# EAGLE schematic PKE Meter v4 (EAGLE 9.7.0)
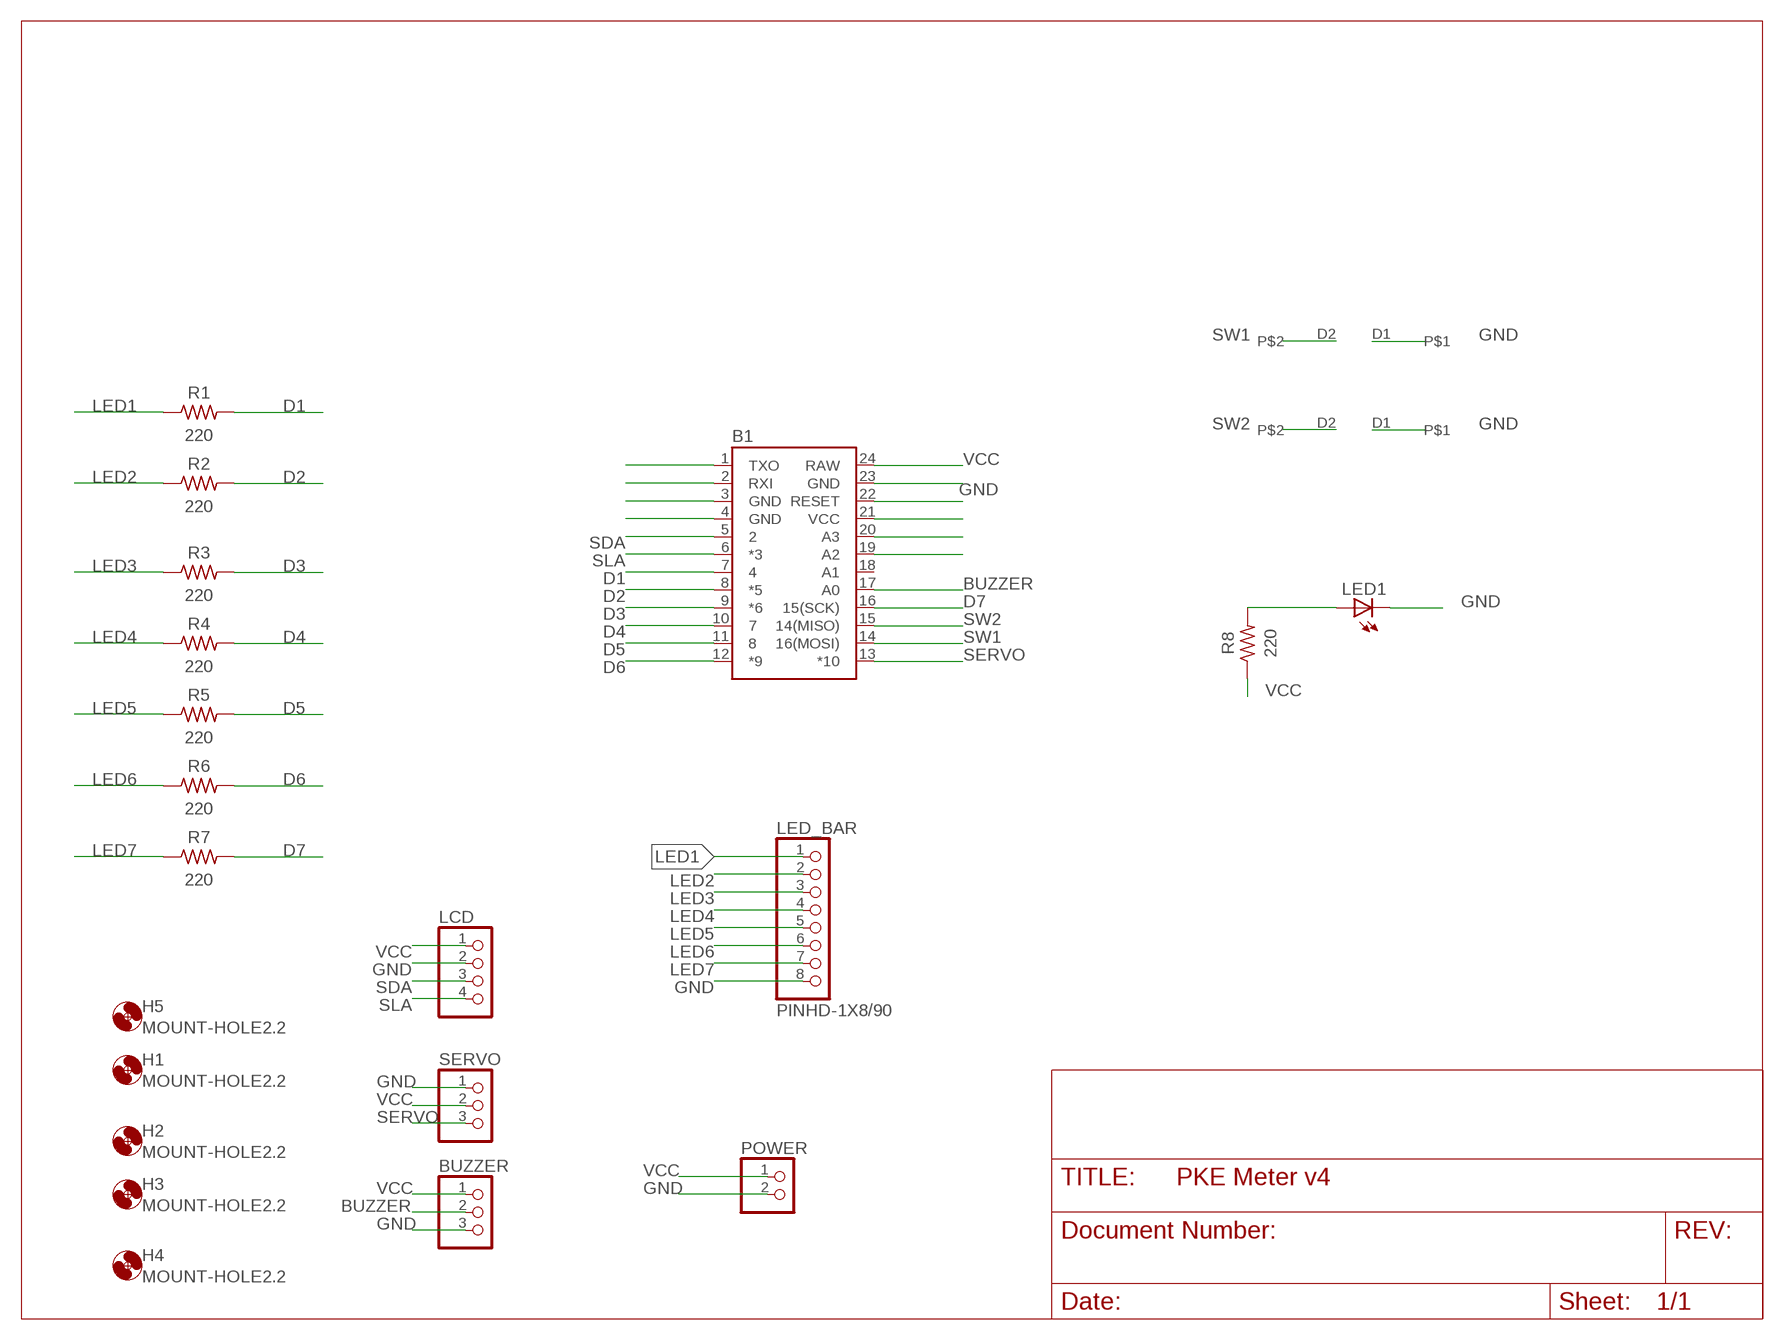
[diagram p0: schematic, sheet 1]

## Parts
B1  SPARKFUN_PRO_MICRO  [SPARKFUN_PRO_MICRO]
BUZZER  PINHD-1X3  [1X03]
H1  MOUNT-HOLE2.2  [2,2]
H2  MOUNT-HOLE2.2  [2,2]
H3  MOUNT-HOLE2.2  [2,2]
H4  MOUNT-HOLE2.2  [2,2]
H5  MOUNT-HOLE2.2  [2,2]
LCD  PINHD-1X4  [1X04]
LED1  LEDSQR2X5  [LED2X5]
LED_BAR  PINHD-1X8/90  [1X08/90]
POWER  PINHD-1X2  [1X02]
R1  220  R-US_AXIAL-11.7MM-PITCH  [RESAD1176W63L850D250B]
R2  220  R-US_AXIAL-11.7MM-PITCH  [RESAD1176W63L850D250B]
R3  220  R-US_AXIAL-11.7MM-PITCH  [RESAD1176W63L850D250B]
R4  220  R-US_AXIAL-11.7MM-PITCH  [RESAD1176W63L850D250B]
R5  220  R-US_AXIAL-11.7MM-PITCH  [RESAD1176W63L850D250B]
R6  220  R-US_AXIAL-11.7MM-PITCH  [RESAD1176W63L850D250B]
R7  220  R-US_AXIAL-11.7MM-PITCH  [RESAD1176W63L850D250B]
R8  220  R-US_AXIAL-7.2MM-PITCH  [RESAD724W46L381D178B]
SERVO  PINHD-1X3  [1X03]
U$1  SWITCH  [SWITCH]
U$2  SWITCH  [SWITCH]

## Nets
BUZZER: B1.17(A0) BUZZER.2
D1: B1.7 R1.2
D2: B1.8(*5) R2.2
D3: B1.9(*6) R3.2
D4: B1.10 R4.2
D5: B1.11 R5.2
D6: B1.12(*9) R6.2
D7: B1.16(15(SCK)) R7.2
GND: B1.23(GND) BUZZER.3 LCD.2 LED1.K(C) LED_BAR.8 POWER.2 SERVO.1 U$1.D1 U$2.D1
LED1: LED_BAR.1 R1.1
LED2: LED_BAR.2 R2.1
LED3: LED_BAR.3 R3.1
LED4: LED_BAR.4 R4.1
LED5: LED_BAR.5 R5.1
LED6: LED_BAR.6 R6.1
LED7: LED_BAR.7 R7.1
N$29: B1.19(A2)
N$30: B1.20(A3)
N$31: B1.4(GND)
N$34: B1.3(GND)
N$35: B1.22(RESET)
N$36: B1.2(RXI)
N$37: B1.1(TXO)
N$38: B1.21(VCC)
N$54: LED1.A R8.2
SDA: B1.5 LCD.3
SERVO: B1.13(*10) SERVO.3
SLA: B1.6(*3) LCD.4
SW1: B1.14(16(MOSI)) U$1.D2
SW2: B1.15(14(MISO)) U$2.D2
VCC: B1.24(RAW) BUZZER.1 LCD.1 POWER.1 R8.1 SERVO.2
Unconnected: B1.18(A1)

## Library data of the parts
B1 = Personal Library:SPARKFUN_PRO_MICRO: SparkFun Pro Micro Atmega32U4 compatible footprint. SparkFun Products: 3.3V/8MHz <https://www.sparkfun.com/products/12587> 5V/16MHz <https://www.sparkfun.com/products/12640>
BUZZER SERVO = adafruit:PINHD-1X3: PIN HEADER
H1-H5 = holes:MOUNT-HOLE: MOUNTING HOLE with drill center marker
LCD = pinhead:PINHD-1X4: PIN HEADER
LED1 = adafruit:LED: LED OSRAM: - CHIPLED LG R971, LG N971, LY N971, LG Q971, LY Q971, LO R971, LY R971 LH N974, LH R974 LS Q976, LO Q976, LY Q976 LO Q996 - Hyper CHIPLED LW Q18S LB Q993, LB Q99A, LB R99A - SideLED LS A670, LO A670, LY A670, LG A670, LP A670 LB A673, LV A673, LT A673, LW A673 LH A674 LY A675 LS A676, LA A676, LO A676, LY A676, LW A676 LS A679, LY A679, LG A679 - Hyper Micro SIDELED® LS Y876, LA Y876, LO Y876, LY Y876 LT Y87S - SmartLED LW L88C, LW L88S LB L89C, LB L89S, LG L890 LS L89K, LO L89K, LY L89K LS L896, LA L896, LO L896, LY L896 - TOPLED LS T670, LO T670, LY T670, LG T670, LP T670 LSG T670, LSP T670, LSY T670, LOP T670, LYG T670 LG T671, LOG T671, LSG T671 LB T673, LV T673, LT T673, LW T673 LH T674 LS T676, LA T676, LO T676, LY T676, LB T676, LH T676, LSB T676, LW T676 LB T67C, LV T67C, LT T67C, LS T67K, LO T67K, LY T67K, LW E67C LS E67B, LA E67B, LO E67B, LY E67B, LB E67C, LV E67C, LT E67C LW T67C LS T679, LY T679, LG T679 LS T770, LO T770, LY T770, LG T770, LP T770 LB T773, LV T773, LT T773, LW T773 LH T774 LS E675, LA E675, LY E675, LS T675 LS T776, LA T776, LO T776, LY T776, LB T776 LHGB T686 LT T68C, LB T68C - Hyper Mini TOPLED® LB M676 - Mini TOPLED Santana® LG M470 LS M47K, LO M47K, LY M47K Source: http://www.osram.convergy.de/
LED_BAR = Connector:PINHD-1X8: PIN HEADER; CATEGORY: CONNECTOR; SUB-CATEGORY: PIN-HEADER
POWER = pinhead:PINHD-1X2: PIN HEADER
R1-R8 = Resistor:R-US: Resistor Fixed - ANSI; CATEGORY: Resistor; SUB-CATEGORY: Fixed
U$1 U$2 = Personal Library:SWITCH